# EAGLE design PixiFlood_20w (EAGLE 7.3.0)
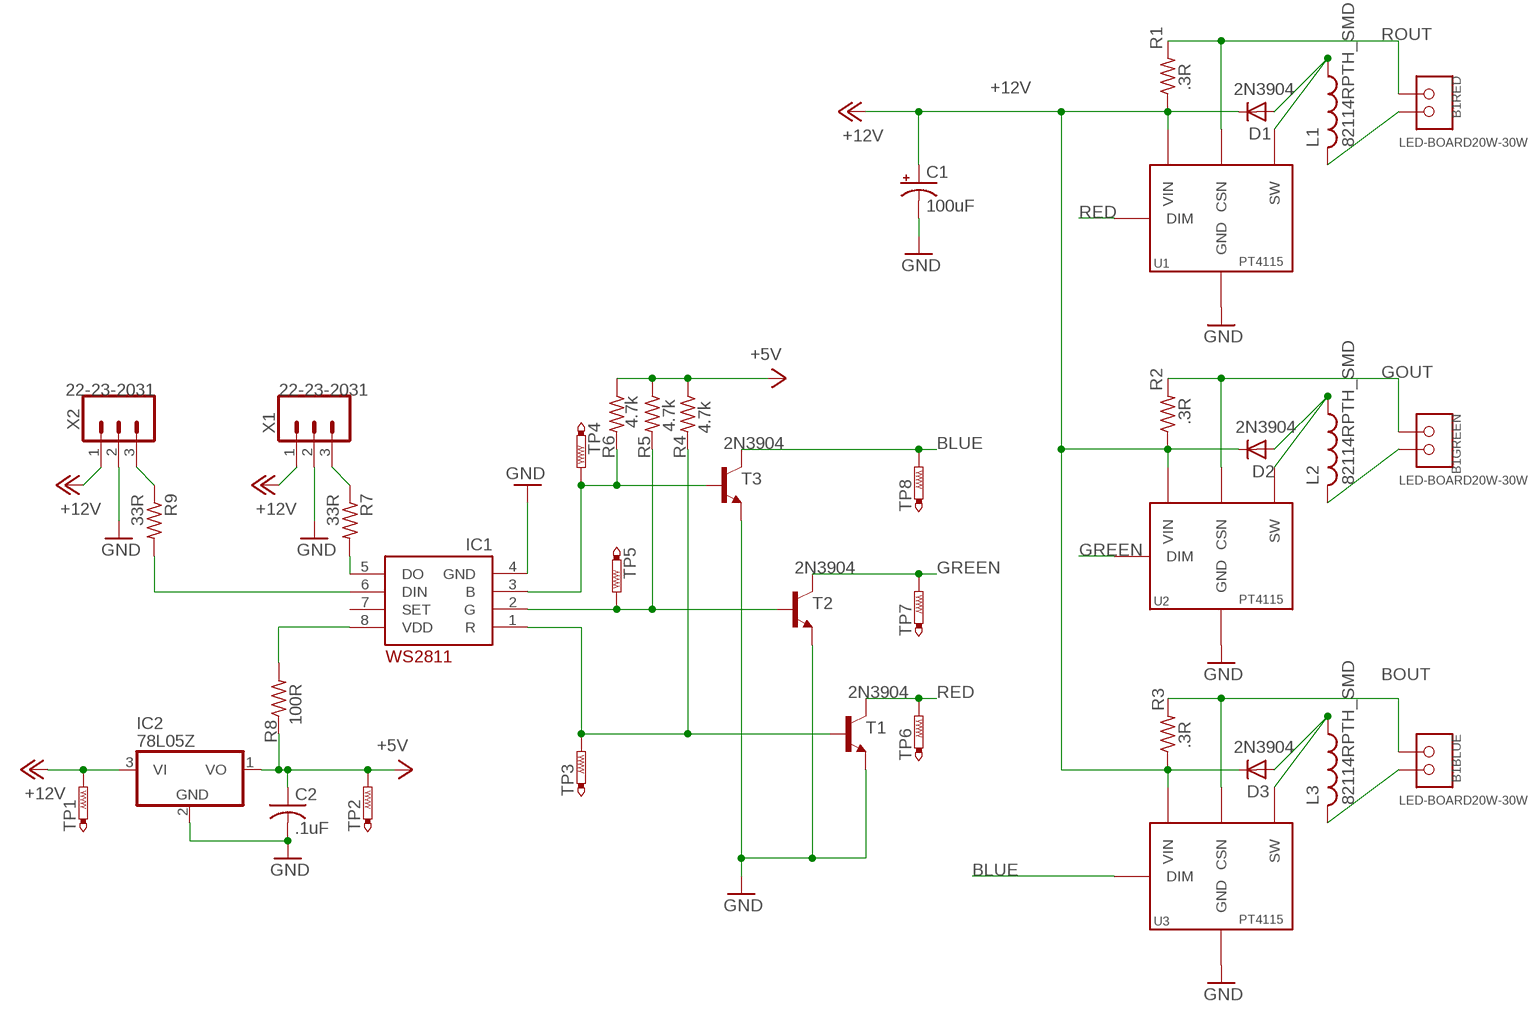
[diagram p0: schematic, sheet 1]

## Parts
B1  LED-BOARD20W-30W  [LED-BOARD-LRG]
C1  100uF  CPOL-USTT2D6L  [TT2D6L]
C2  .1uF  C-US050-024X044  [C050-024X044]
D1  2N3904  DIODE-DO07  [DO07]
D2  2N3904  DIODE-DO07  [DO07]
D3  2N3904  DIODE-DO07  [DO07]
IC1  WS2811-SOP8  [SO08-SKINNYPADS]
IC2  78L05Z  [TO92]
L1  82114RPTH_SMD  [INDUCTOR]
L2  82114RPTH_SMD  [INDUCTOR]
L3  82114RPTH_SMD  [INDUCTOR]
R1  .3R  R-US_0204/7  [0204/7]
R2  .3R  R-US_0204/7  [0204/7]
R3  .3R  R-US_0204/7  [0204/7]
R4  4.7k  R-US_0204/7  [0204/7]
R5  4.7k  R-US_0204/7  [0204/7]
R6  4.7k  R-US_0204/7  [0204/7]
R7  33R  R-US_0204/7  [0204/7]
R8  100R  R-US_0204/7  [0204/7]
R9  33R  R-US_0204/7  [0204/7]
T1  2N3904  [TO92]
T2  2N3904  [TO92]
T3  2N3904  [TO92]
TP1  PTR1B2,54  [B2,54]
TP2  PTR1B2,54  [B2,54]
TP3  PTR1B1,27  [B1,27]
TP4  PTR1B1,27  [B1,27]
TP5  PTR1B1,27  [B1,27]
TP6  PTR1B1,27  [B1,27]
TP7  PTR1B1,27  [B1,27]
TP8  PTR1B1,27  [B1,27]
U1  PT4115B89E  [SOT89-5]
U2  PT4115B89E  [SOT89-5]
U3  PT4115B89E  [SOT89-5]
X1  22-23-2031  [22-23-2031]
X2  22-23-2031  [22-23-2031]

## Nets
+5V: C2.1 IC2.1(VO) R4.1 R5.1 R6.1 R8.1 TP2.TP
+12V: C1.+ D1.C D2.C D3.C IC2.3(VI) R1.1 R2.1 R3.1 TP1.TP U1.5(VIN) U2.5(VIN) U3.5(VIN) X1.1 X2.1
BLUE: T3.1(C) TP8.TP U3.3(DIM)
BOUT: B1.B+ B1.B+@2 R3.2 U3.4(CSN)
GND: C1.- C2.2 IC1.4(GND) IC2.2(GND) T1.3(E) T2.3(E) T3.3(E) U1.2(GND) U1.2@1(GND) U1.2@2(GND) U1.2@3(GND) U2.2(GND) U2.2@1(GND) U2.2@2(GND) U2.2@3(GND) U3.2(GND) U3.2@1(GND) U3.2@2(GND) U3.2@3(GND) X1.2 X2.2
GOUT: B1.G+ B1.G+@1 R2.2 U2.4(CSN)
GREEN: T2.1(C) TP7.TP U2.3(DIM)
N$1: D1.A L1.1 L1.1@A U1.1(SW)
N$2: D3.A L3.1 L3.1@A U3.1(SW)
N$3: B1.R- B1.R-@1 L1.2 L1.2@A
N$4: R7.1 X1.3
N$5: D2.A L2.1 L2.1@A U2.1(SW)
N$6: R9.1 X2.3
N$7: IC1.5(DO) R7.2
N$8: IC1.6(DIN) R9.2
N$9: B1.G- B1.G-@1 L2.2 L2.2@A
N$10: B1.B- B1.B-@1 L3.2 L3.2@A
N$15: IC1.3(B) R6.2 T3.2(B) TP4.TP
N$18: IC1.2(G) R5.2 T2.2(B) TP5.TP
N$20: IC1.1(R) R4.2 T1.2(B) TP3.TP
RED: T1.1(C) TP6.TP U1.3(DIM)
ROUT: B1.R+ B1.R+@1 R1.2 U1.4(CSN)
VDD: IC1.8(VDD) R8.2
Unconnected: IC1.7(SET)

## Library data of the parts
B1 = special:LED-BOARD
C1 = rcl:CPOL-US: POLARIZED CAPACITOR, American symbol
C2 = rcl:C-US: CAPACITOR, American symbol
D1-D3 = diode:DIODE-: DIODE
IC1 = MyLibrary:WS2811
IC2 = linear:78*: Positive VOLTAGE REGULATOR Source: http://cache.national.com/ds/LM/LM78L05.pdf http://www.fairchildsemi.com/ds/LM/LM7805.pdf
L1-L3 = inductors:82114R: INDUCTOR
R1-R6 = resistor:R-US_: RESISTOR, American symbol
R7-R9 = rcl:R-US_: RESISTOR, American symbol
T1-T3 = transistor:2N3904: NPN TRANSISTOR
TP1-TP8 = testpad:PTR1: TEST PIN
U1-U3 = drivers:PT4115: 30V, 1.2A Step-down High Brightness LED Driver with 5000:1 Dimming PDF: http://www.google.pl/url?sa=t&rct=j&q=PT4115&source=web&cd=1&ved=0CC4QFjAA&url=http%3A%2F%2Fwww.micro-bridge.com%2Fdata%2FCRpowtech%2FPT4115E.pdf&ei=9NbxUKXPJNSzhAem2oGoAQ&usg=AFQjCNEsPWIIWjIVjxpF5YN6SPR3coTTpw&bvm=bv.1357700187,d.d2k
X1 X2 = MyLibrary:22-23-2031: .100" (2.54mm) Center Header - 3 Pin; MF: MOLEX; MPN: 22-23-2031; OC_FARNELL: 1462950; OC_NEWARK: 30C0862

## Board
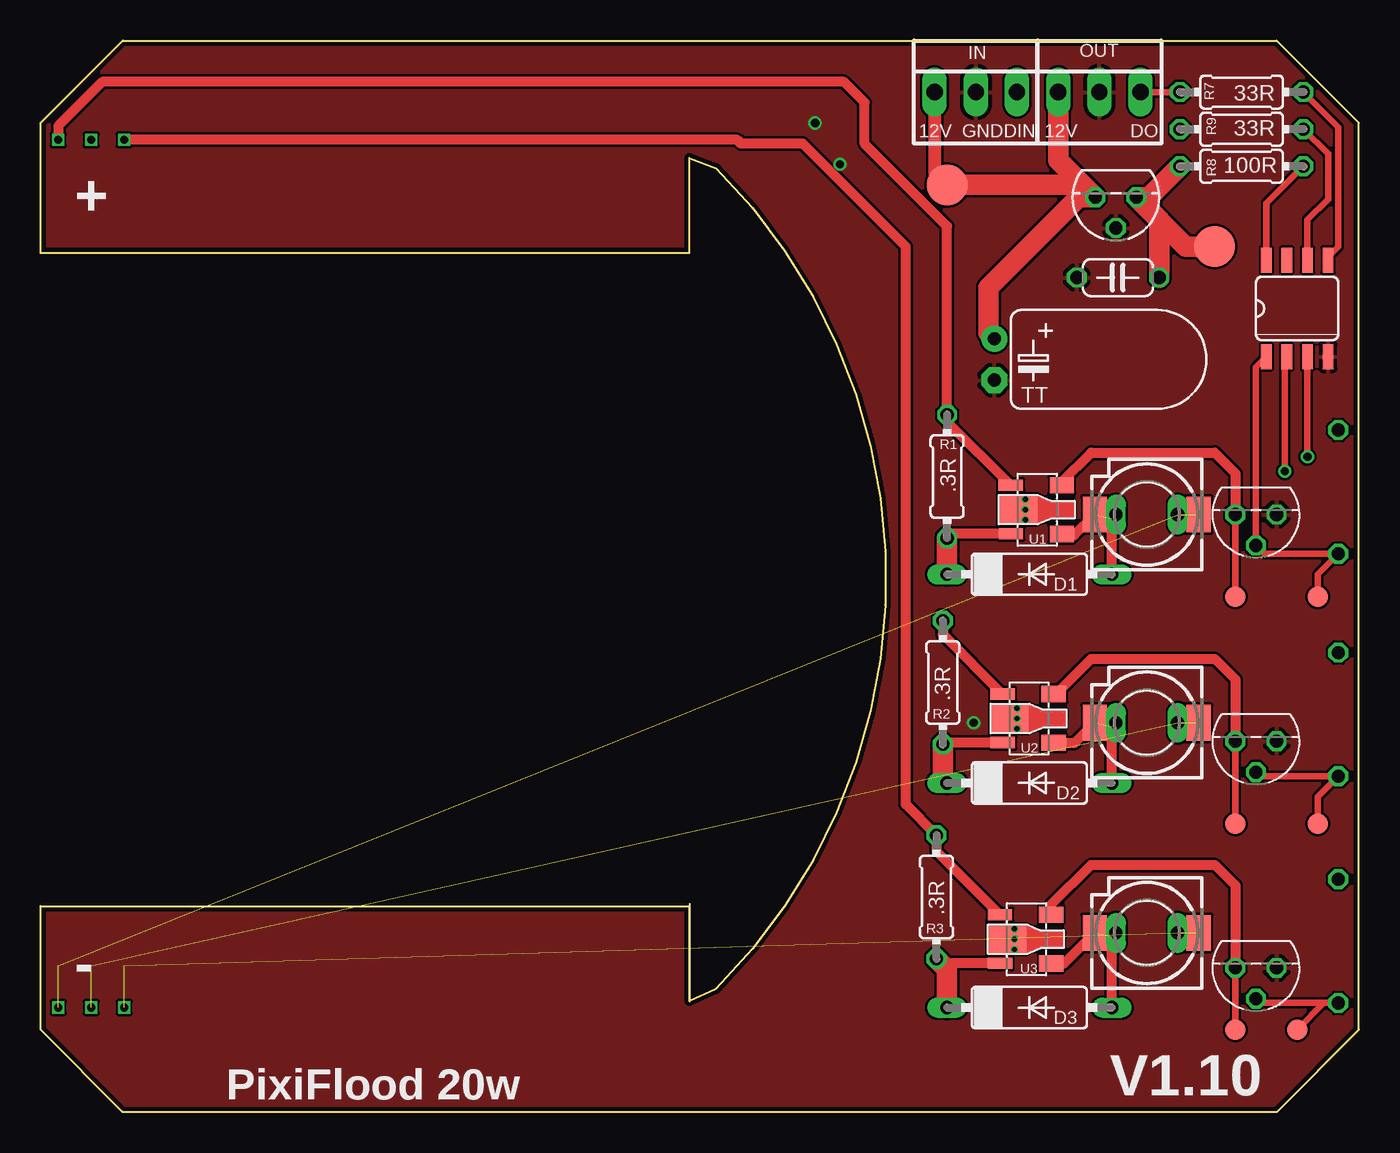
[diagram p1: board, top side]
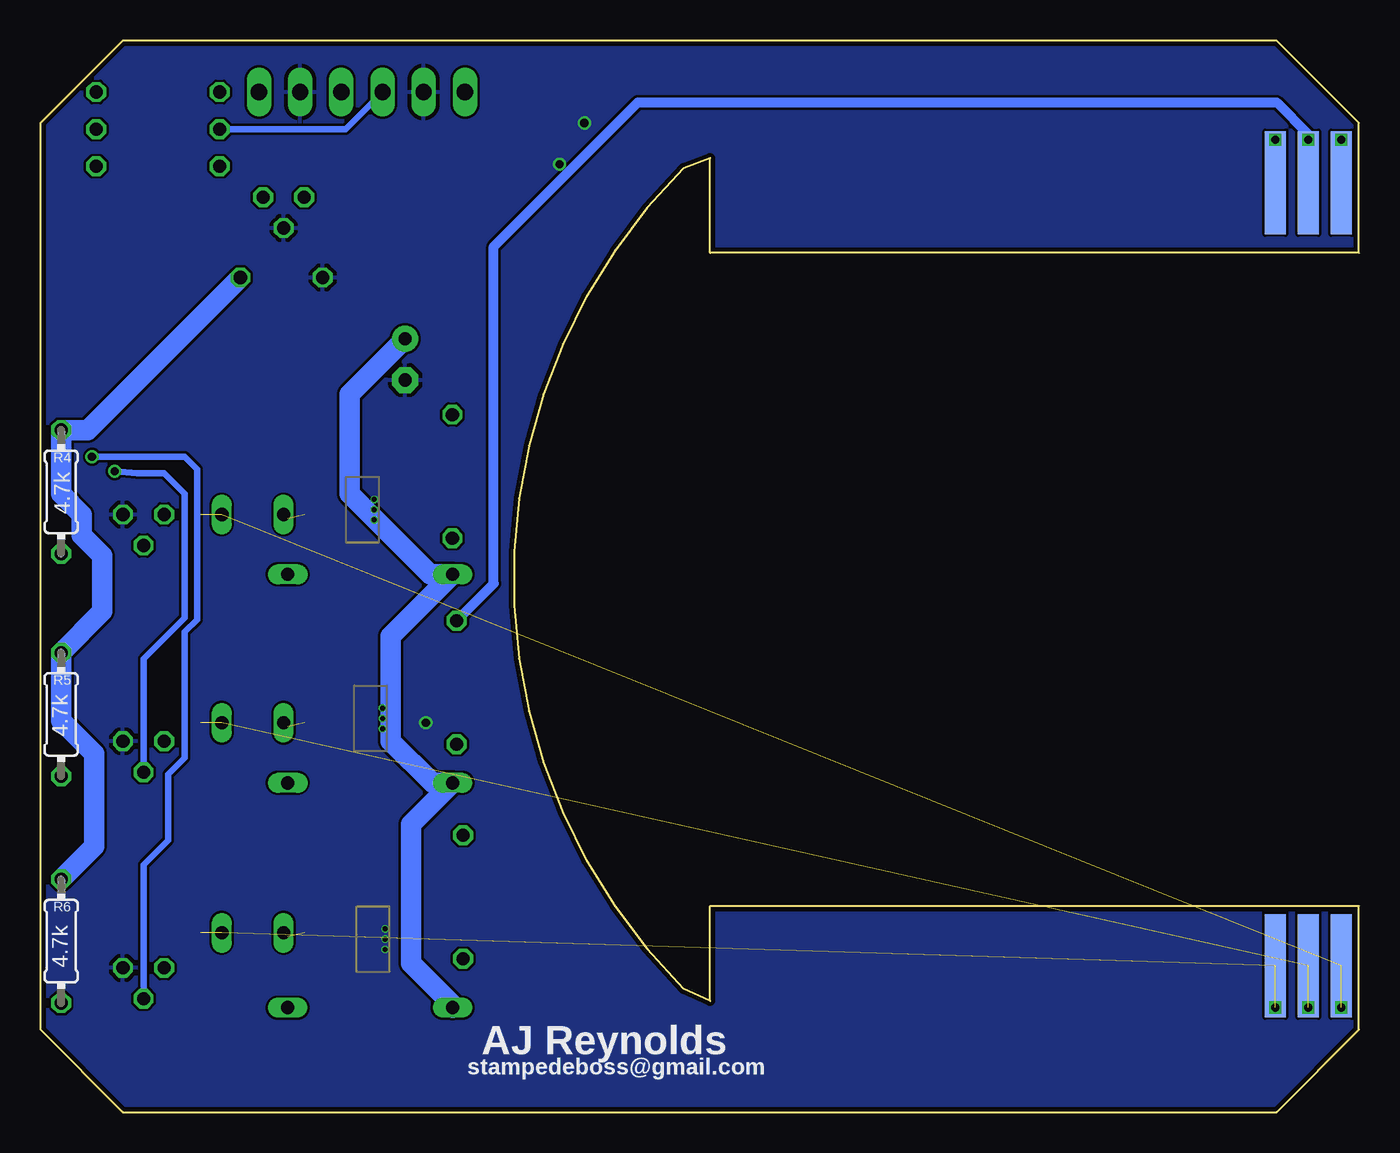
[diagram p2: board, bottom side, seen from below]

Size 81.28 x 66.04 mm. Coordinates in mm from the lower left corner, seen from the top.
Copper layers (1*16): Top 0.035mm / dielectric 1.5mm / Bottom 0.035mm
Design rules "default *": minimum track width 5mil, minimum drill 12mil, track to track 6mil, track to pad 6mil, pad to pad 6mil, via to via 6mil, smd to smd 0mil, copper to edge 10mil, drill to drill 10mil, minimum pad ring 0mil, minimum via ring 6mil, stop-mask expansion 2mil, vias tented up to drill 100mil, thermal gap 10mil

### Footprints (pad centres in the part's own frame; a part is rotated, then mirrored left to right if it is on the bottom)
LED-BOARD-LRG = smd 1.27 x 6.35 bottom: B+ 5.156,57.277; B- 5.156,9.017; G+ 3.124,57.277; G- 3.124,9.017; R+ 1.092,57.277; R- 1.092,9.017 | drill 0.5 square: B+@2 5.156,59.919; B-@1 5.156,6.452; G+@1 3.124,59.919; G-@1 3.124,6.452; R+@1 1.092,59.919; R-@1 1.092,6.452
TT2D6L = drill 0.813 pad 1.6: + -1.27,0 | drill 0.813 pad 1.6 octagon: - 1.27,0
C050-024X044 = drill 0.813 octagon: 1 -2.54,0; 2 2.54,0
DO07 = drill 0.813 long: A 5.08,0; C -5.08,0
SO08-SKINNYPADS = smd 0.66 x 1.524: 1 -1.905,-2.973; 2 -0.635,-2.973; 3 0.635,-2.973; 4 1.905,-2.973; 5 1.905,2.973; 6 0.635,2.973; 7 -0.635,2.973; 8 -1.905,2.973
TO92 = drill 0.813 octagon: 1 -1.27,0; 2 0,1.905; 3 1.27,0
INDUCTOR = smd 2.2 x 1.5: 1 0,-3.2; 2 0,3.2 | drill 0.813 long: 1@A 0,-1.905; 2@A 0,1.905
0204/7 = drill 0.813 octagon: 1 -3.81,0; 2 3.81,0
TO92' = drill 0.813 octagon: 1 1.27,0; 2 0,1.905; 3 -1.27,0
B2,54 = smd 2.54 x 2.54: TP 0,0
B1,27 = smd 1.27 x 1.27: TP 0,0
SOT89-5 = smd 1 x 1.5: 1 -1.496,-1.496; 3 1.505,-1.498 | smd 1.778 x 2.286: 2 0.006,1.201 | drill 0.305 pad 0.305: 2@1 -0.635,0.762; 2@2 0,0.762; 2@3 0.635,0.762 | smd 0.7 x 1.5: 4 1.504,1.654; 5 -1.487,1.645
22-23-2031 = drill 1 long: 1 -2.54,0; 2 0,0; 3 2.54,0

### Placement (x,y rotation side)
B1  0,0 0 top
C1  58.8,46.39 270 top
C2  66.42,51.44 180 top
D1  60.96,33.15 0 top
D2  60.96,20.29 0 top
D3  60.96,6.45 0 top
IC1  77.47,49.53 0 top
IC2  66.29,56.39 180 top
L1  68.2,36.83 270 top
L2  68.2,24 270 top
L3  68.2,11.05 270 top
R1  55.89,39.18 90 top
R2  55.63,26.48 90 top
R3  55.23,13.26 90 top
R4  80.01,38.23 270 bottom
R5  80.01,24.51 270 bottom
R6  80.01,10.54 270 bottom
R7  74.04,62.87 0 top
R8  74.04,58.29 0 top
R9  74.04,60.58 0 top
T1  2N3904  [TO92']  74.93,36.83 180 top
T2  2N3904  [TO92']  74.93,22.86 180 top
T3  2N3904  [TO92']  74.93,8.89 180 top
TP1  55.88,57.15 0 top
TP2  72.39,53.34 0 top
TP3  78.74,31.75 0 top
TP4  77.47,5.08 0 top
TP5  78.74,17.78 0 top
TP6  73.66,31.75 0 top
TP7  73.66,17.78 0 top
TP8  73.66,5.08 0 top
U1  61.47,37.13 90 top
U2  60.96,24.26 90 top
U3  60.8,10.66 90 top
X1  65.28,62.87 0 top
X2  57.66,62.87 0 top

### Tracks (layer width: path | path; a pad name or v marks a point on that pad's centre or on a via)
+5V
  Top 1.27: TP2.TP 70.61,53.34 IC2.1 | IC2.1 68.33,56.39 R8.1 | C2.1 68.96,54.99 IC2.1
  Bottom 1.27: C2.1 78.36,42.04 R4.1 80.01,38.1 78.74,36.83 78.74,35.56 77.47,34.29 77.47,30.86 R5.1 80.01,24.13 77.98,22.1 77.98,16.38 R6.1
+12V
  Top 0.61: U1.5 56.17,35.65 R1.1 | U2.5 55.73,22.77 R2.1 | U3.5 56.16,9.17 55.84,8.85
  Top 0.813: 55.88,35.36 R1.1 | X2.1 55.12,57.91 TP1.TP
  Top 1.27: D3.C 55.88,8.8 55.84,8.85 R3.1 | D1.C 55.88,35.36 | R2.1 55.63,20.54 D2.C | X1.1 62.74,58.67 IC2.3 | IC2.3 64.01,56.39 58.42,50.8 58.42,48.04 C1.+ | TP1.TP 64.26,57.15 IC2.3
  Bottom 1.27: D3.C 55.88,6.63 58.42,9.17 58.42,17.75 D2.C 57.12,20.29 59.69,22.86 59.69,29.34 D1.C 57.28,33.15 62.23,38.1 62.23,44.23 C1.+
BLUE
  Top 0.406: T3.1 TP8.TP
  Top 0.61: U3.3 62.3,12.77 64.77,15.24 72.39,15.24 73.66,13.97 T3.1
BOUT
  Top 0.61: U3.4 55.23,16.08 R3.2 53.34,18.96 53.34,53.34 46.99,59.69 43.18,59.69 42.95,59.92 B1.B+@2
  Bottom 0.61: B1.B+ B1.B+@2
GND  (via drill 0.51)
  other vias: 47.75,60.96 49.28,58.42 57.53,24
  pour Bottom: 0,0 81.28,0 81.28,66.55 0,66.55
  pour Top: 0,0 81.28,0 81.28,66.55 0,66.55
GOUT
  Top 0.61: R2.2 55.63,29.45 U2.4
  Bottom 0.61: B1.G+ B1.G+@1 3.12,60.27 5.08,62.23 44.45,62.23 53.34,53.34 53.34,32.58 R2.2
GREEN
  Top 0.406: TP7.TP T2.1
  Top 0.61: U2.3 62.6,25.77 64.77,27.94 72.39,27.94 73.66,26.67 T2.1
N$1  (1 unrouted)
  Top 0.61: D1.A 66.04,36.58 L1.1@A | 63.36,35.55 63.72,35.55 L1.1
  Top 0.813: 63.36,35.55 U1.1
N$2  (1 unrouted)
  Top 0.61: U3.1 63.11,9.16 L3.1 | D3.A 66.04,10.8 L3.1@A
N$3  (3 unrouted)
N$4
  Top 0.406: X1.3 R7.1
N$5  (1 unrouted)
  Top 0.61: D2.A 66.04,23.75 L2.1@A | U2.1 63.76,22.77 L2.1
N$6
  Bottom 0.406: X2.3 62.48,60.58 R9.1
N$7
  Top 0.406: R7.2 80.01,60.71 80.01,53.34 79.38,52.7 IC1.5
N$8
  Top 0.406: R9.2 79.38,59.05 79.38,56.26 78.11,54.99 IC1.6
N$9  (3 unrouted)
N$10  (3 unrouted)
N$15  (via drill 0.51)
  Top 0.406: IC1.3 v78.11,40.39 | T3.2 75.18,6.73 R6.2 79.12,6.73 TP4.TP
  Bottom 0.406: v78.11,40.39 72.39,40.39 71.63,39.62 71.63,30.35 72.39,29.59 72.39,21.84 73.41,20.83 73.41,16.76 74.93,15.24 T3.2
N$18  (via drill 0.51)
  Top 0.406: IC1.2 76.71,46.43 v76.71,39.5 | T2.2 75.18,20.7 R5.2 78.74,19.43 TP5.TP
  Bottom 0.406: v76.71,39.5 75.31,39.37 73.66,39.37 72.39,38.1 72.39,30.48 74.93,27.94 T2.2
N$20
  Top 0.406: IC1.1 74.93,45.92 T1.2 75.44,34.42 R4.2 78.74,33.15 TP3.TP
RED
  Top 0.406: TP6.TP T1.1
  Top 0.61: U1.3 62.97,38.84 64.77,40.64 72.39,40.64 73.66,39.37 T1.1
ROUT
  Top 0.61: U1.4 55.89,42.56 R1.2 55.89,54.6 50.8,59.69 50.8,62.23 49.53,63.5 3.81,63.5 1.09,60.78 B1.R+@1
  Bottom 0.61: B1.R+ B1.R+@1
VDD
  Top 0.406: R8.2 75.56,56.01 IC1.8

### Text on the board
tPlace: IN | OUT | 12V | GND | DIN | 12V | DO | V1.10 | PixiFlood 20w
bPlace: AJ Reynolds | stampedeboss@gmail.com